# EAGLE schematic stepper_fw_bw_w_switch (EAGLE 6.4)
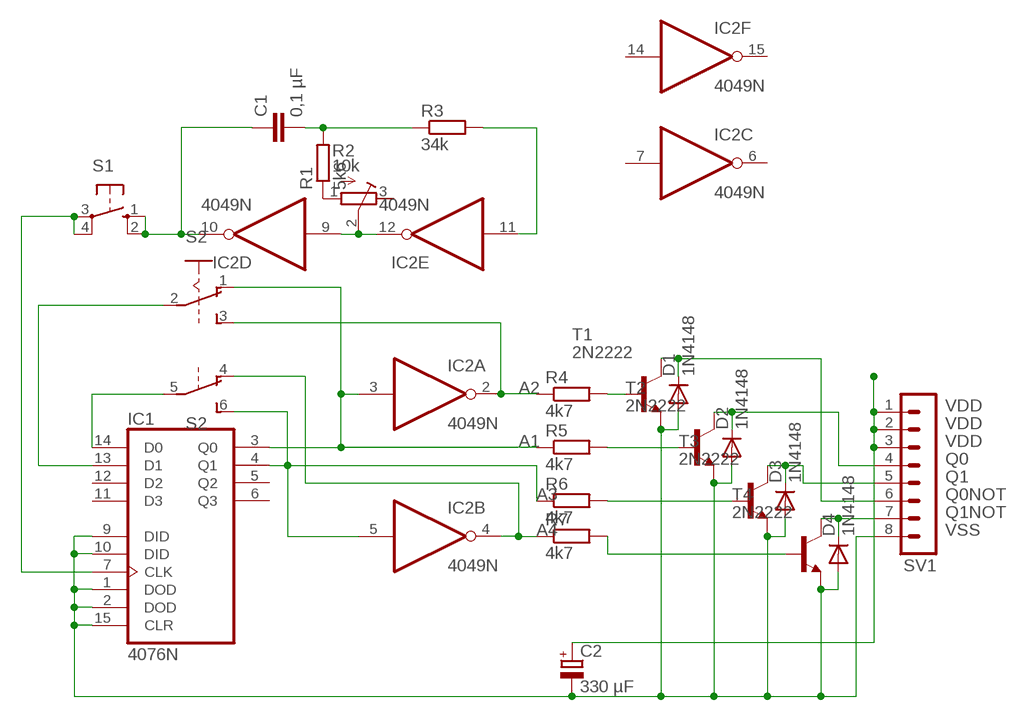
[diagram p0: schematic, sheet 1]

## Parts
C1  0,1 µF  C-EU050-024X044  [C050-024X044]
C2  330 µF  CPOL-EUE2.5-5  [E2,5-5]
D1  1N4148  DIODE-D-2.5  [D-2.5]
D2  1N4148  DIODE-D-2.5  [D-2.5]
D3  1N4148  DIODE-D-2.5  [D-2.5]
D4  1N4148  DIODE-D-2.5  [D-2.5]
IC1  4076N  [DIL16]
IC2  4049N  [DIL16]
R1  5k6  R-EU_0207/10  [0207/10]
R2  10k  R-TRIMM64W  [RTRIM64W]
R3  34k  R-EU_0207/10  [0207/10]
R4  4k7  R-EU_0207/10  [0207/10]
R5  4k7  R-EU_0207/10  [0207/10]
R6  4k7  R-EU_0207/10  [0207/10]
R7  4k7  R-EU_0207/10  [0207/10]
S1  40-XX  [B3F-40XX]
S2  A68-A31  [A68-A31]
SV1  MA08-1  [MA08-1]
T1  2N2222  [TO18]
T2  2N2222  [TO18]
T3  2N2222  [TO18]
T4  2N2222  [TO18]

## Nets
A1: IC1.3(Q0) IC2.3(A:I) R5.1 S2.1(A:O)
A2: IC2.2(A:O) R4.1 S2.3(A:S)
A3: IC1.4(Q1) IC2.5(B:I) R6.1 S2.6(B:S)
A4: IC2.4(B:O) R7.1 S2.4(B:O)
N$1: IC2.9(D:I) IC2.12(E:O) R2.2(S)
N$2: IC1.7(CLK) S1.3(P) S1.4(P1)
N$3: C1.2 R1.2 R3.1
N$4: IC2.11(E:I) R3.2
N$5: C1.1 IC2.10(D:O) S1.1(S) S1.2(S1)
N$6: R1.1 R2.1(A)
N$7: IC1.13(D1) S2.2(A:P)
N$8: IC1.14(D0) S2.5(B:P)
N$9: R4.2 T1.2(B)
N$10: R5.2 T2.2(B)
N$11: R6.2 T3.2(B)
N$12: R7.2 T4.2(B)
Q0: D2.C SV1.4 T2.3(C)
Q0NOT: D1.C SV1.6 T1.3(C)
Q1: D3.C SV1.5 T3.3(C)
Q1NOT: D4.C SV1.7 T4.3(C)
VDD: C2.+ SV1.1 SV1.2 SV1.3
VSS: C2.- D1.A D2.A D3.A D4.A IC1.1(DOD) IC1.2(DOD) IC1.9(DID) IC1.10(DID) IC1.15(CLR) SV1.8 T1.1(E) T2.1(E) T3.1(E) T4.1(E)
Unconnected: IC1.5(Q2) IC1.6(Q3) IC1.11(D3) IC1.12(D2) IC2.6(C:O) IC2.7(C:I) IC2.14(F:I) IC2.15(F:O) R2.3(E)

## Power pins joined to a net without a drawn wire
VDD: IC1.16(VDD) IC2.1(P:VDD)
VSS: IC1.8(VSS) IC2.8(P:VSS)

## Library data of the parts
C1 = rcl:C-EU: CAPACITOR, European symbol
C2 = rcl:CPOL-EU: POLARIZED CAPACITOR, European symbol
D1-D4 = diode:DIODE-: DIODE
IC1 = 40xx:4076: Quad D-type REGISTER
IC2 = 40xx:4049: Hex inverting BUFFER
R1 R3-R7 = rcl:R-EU_: RESISTOR, European symbol
R2 = rcl:R-TRIMM: Trimm resistor
S1 = switch-omron:40-XX: OMRON SWITCH; MF: OMRON COMPONENTS USA; MPN: B3F-4000; OC_FARNELL: 176434; OC_NEWARK: 36K3105
S2 = switch:A68-A31: SLIDING SWITCH Siemens, distributor Buerklin, 11G766
SV1 = con-lstb:MA08-1: PIN HEADER; OC_FARNELL: unknown; OC_NEWARK: unknown
T1-T4 = transistor:2N2222: NPN TRANSISTOR